# Altium schematic sheet Sitara_IO_Bank_45.SchDoc
size A3; SheetNumber: 8; SheetTotal: 10
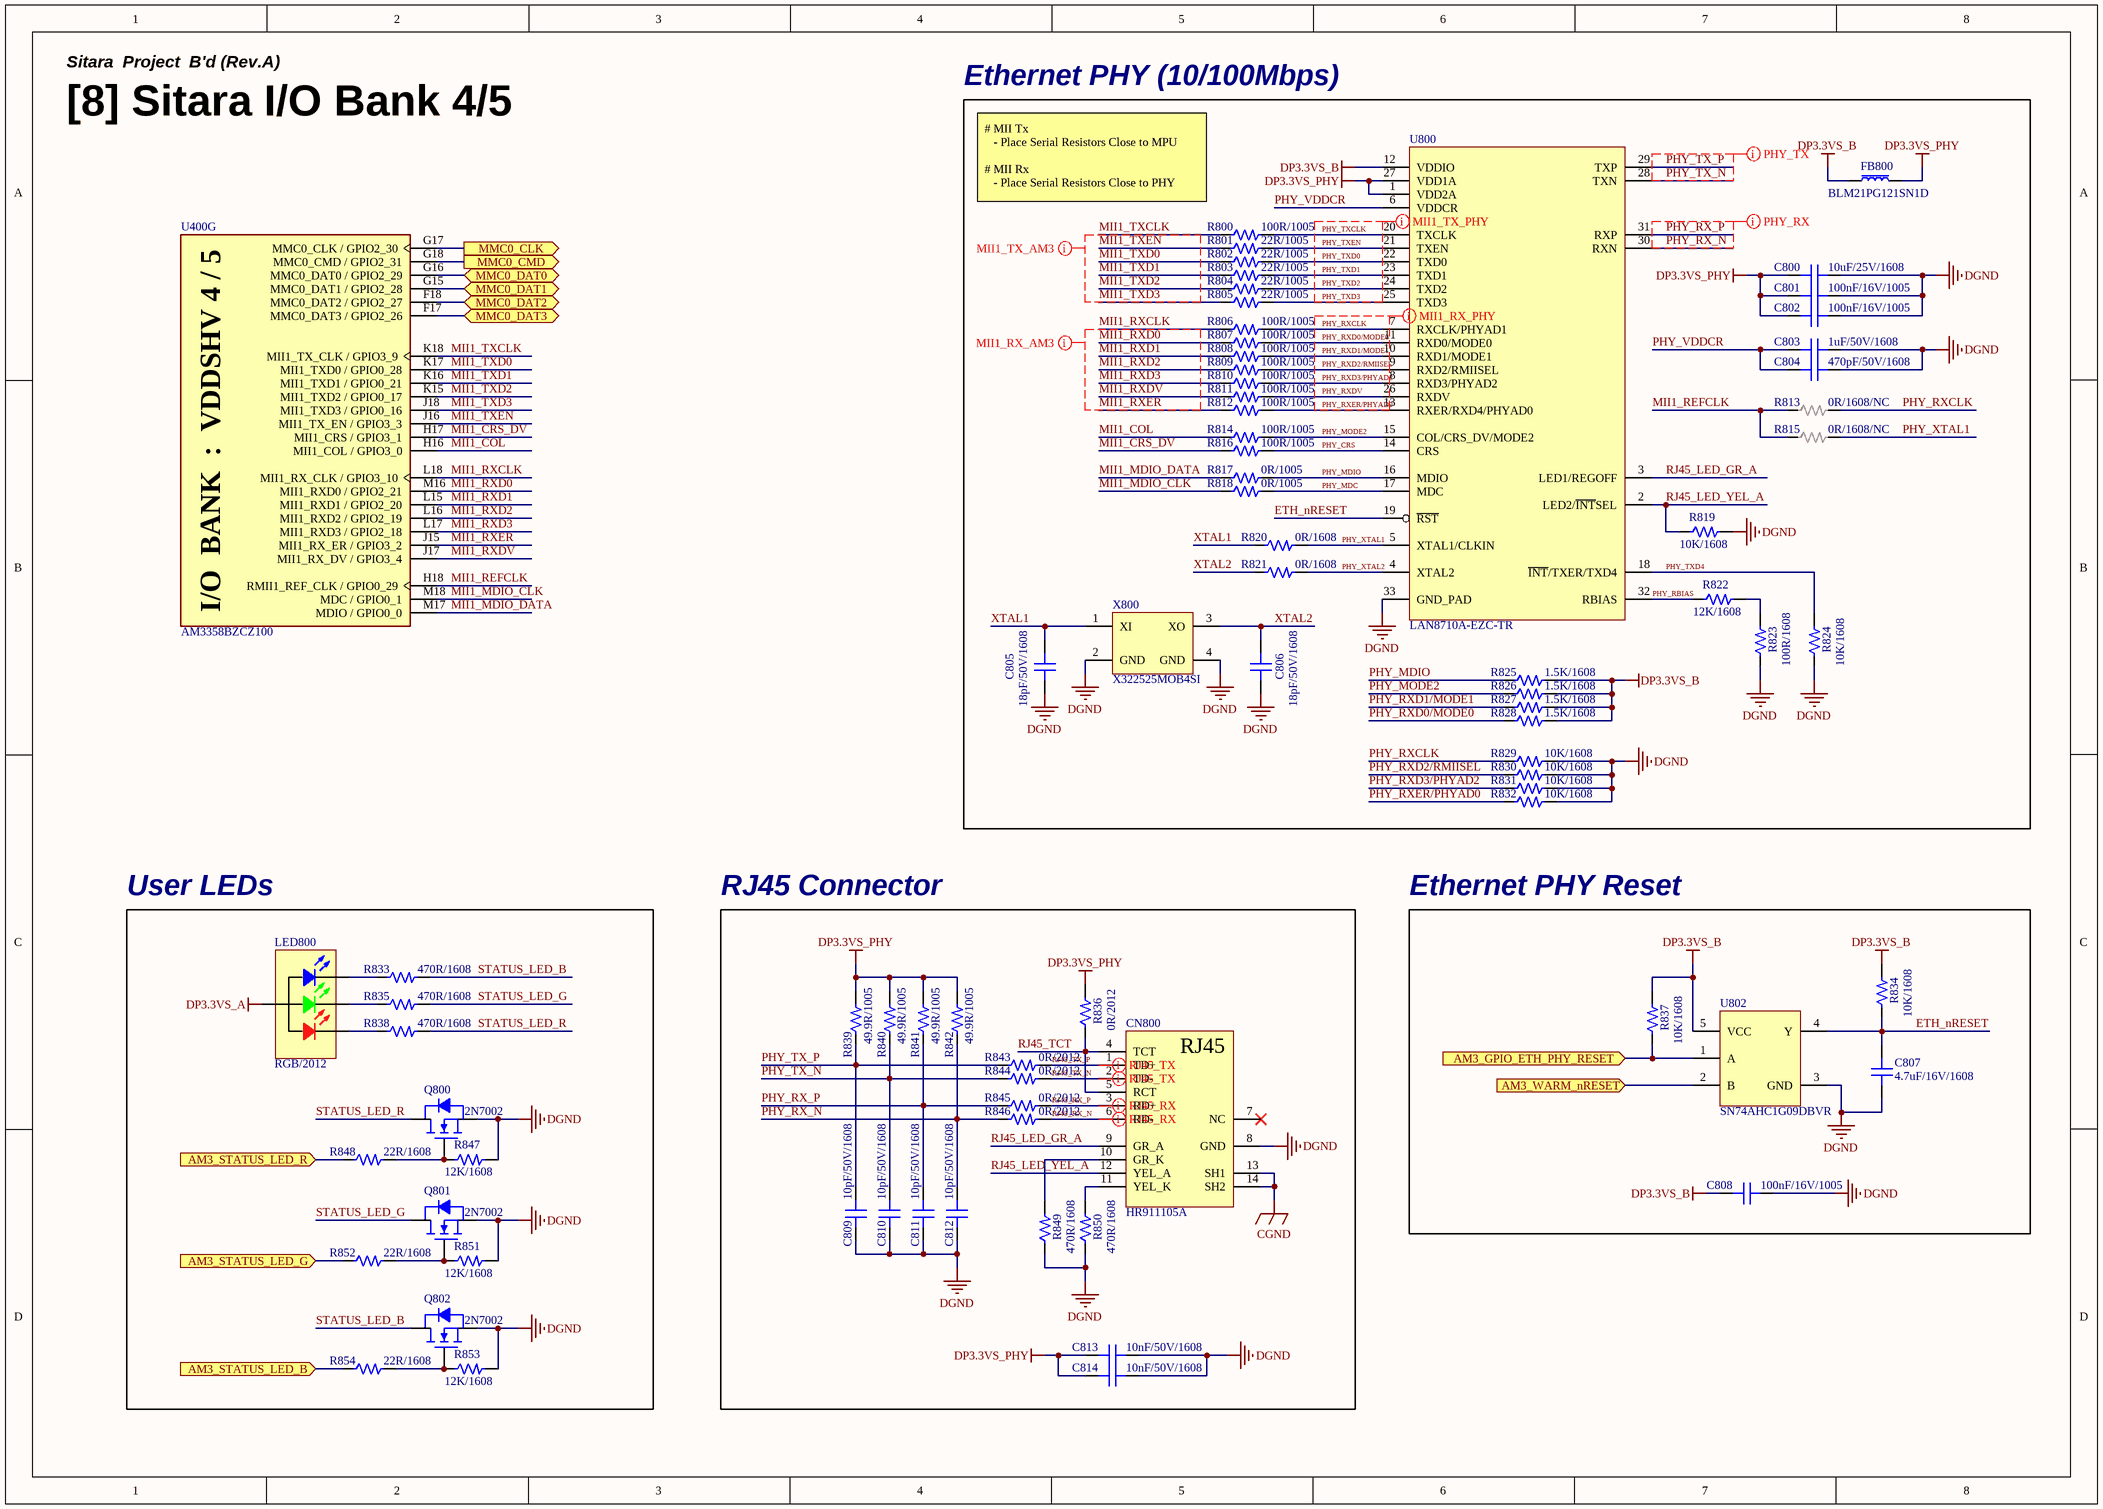
[diagram p0: Sitara_IO_Bank_45.SchDoc]

## Parts
C800  10uF/25V/1608  [CAP 1608 (0603_INCH)]
C801  100nF/16V/1005  [CAP 1005 (0402_INCH)]
C802  100nF/16V/1005  [CAP 1005 (0402_INCH)]
C803  1uF/50V/1608  [CAP 1608 (0603_INCH)]
C804  470pF/50V/1608  [CAP 1608 (0603_INCH)]
C805  18pF/50V/1608  [CAP 1608 (0603_INCH)]
C806  18pF/50V/1608  [CAP 1608 (0603_INCH)]
C807  4.7uF/16V/1608  [CAP 1608 (0603_INCH)]
C808  100nF/16V/1005  [CAP 1005 (0402_INCH)]
C809  10pF/50V/1608  [CAP 1608 (0603_INCH)]
C810  10pF/50V/1608  [CAP 1608 (0603_INCH)]
C811  10pF/50V/1608  [CAP 1608 (0603_INCH)]
C812  10pF/50V/1608  [CAP 1608 (0603_INCH)]
C813  10nF/50V/1608  [CAP 1608 (0603_INCH)]
C814  10nF/50V/1608  [CAP 1608 (0603_INCH)]
CN800  HR911105A  [CON_RJ45]
FB800  BLM21PG121SN1D  [FB 2012 (0805_inch)]
LED800  RGB/2012  [LED MHT170RGBCT]
Q800  2N7002  [SOT 23-3 (DIODES INCORPORATED)]
Q801  2N7002  [SOT 23-3 (DIODES INCORPORATED)]
Q802  2N7002  [SOT 23-3 (DIODES INCORPORATED)]
R800  100R/1005  [RES 1005 (0402_inch)]
R801  22R/1005  [RES 1005 (0402_inch)]
R802  22R/1005  [RES 1005 (0402_inch)]
R803  22R/1005  [RES 1005 (0402_inch)]
R804  22R/1005  [RES 1005 (0402_inch)]
R805  22R/1005  [RES 1005 (0402_inch)]
R806  100R/1005  [RES 1005 (0402_inch)]
R807  100R/1005  [RES 1005 (0402_inch)]
R808  100R/1005  [RES 1005 (0402_inch)]
R809  100R/1005  [RES 1005 (0402_inch)]
R810  100R/1005  [RES 1005 (0402_inch)]
R811  100R/1005  [RES 1005 (0402_inch)]
R812  100R/1005  [RES 1005 (0402_inch)]
R813  0R/1608/NC  [RES 1608 (0603_inch)/NC]
R814  100R/1005  [RES 1005 (0402_inch)]
R815  0R/1608/NC  [RES 1608 (0603_inch)/NC]
R816  100R/1005  [RES 1005 (0402_inch)]
R817  0R/1005  [RES 1005 (0402_inch)]
R818  0R/1005  [RES 1005 (0402_inch)]
R819  10K/1608  [RES 1608 (0603_inch)]
R820  0R/1608  [RES 1608 (0603_inch)]
R821  0R/1608  [RES 1608 (0603_inch)]
R822  12K/1608  [RES 1608 (0603_inch)]
R823  100R/1608  [RES 1608 (0603_inch)]
R824  10K/1608  [RES 1608 (0603_inch)]
R825  1.5K/1608  [RES 1608 (0603_inch)]
R826  1.5K/1608  [RES 1608 (0603_inch)]
R827  1.5K/1608  [RES 1608 (0603_inch)]
R828  1.5K/1608  [RES 1608 (0603_inch)]
R829  10K/1608  [RES 1608 (0603_inch)]
R830  10K/1608  [RES 1608 (0603_inch)]
R831  10K/1608  [RES 1608 (0603_inch)]
R832  10K/1608  [RES 1608 (0603_inch)]
R833  470R/1608  [RES 1608 (0603_inch)]
R834  10K/1608  [RES 1608 (0603_inch)]
R835  470R/1608  [RES 1608 (0603_inch)]
R836  0R/2012  [RES 2012 (0805_inch)]
R837  10K/1608  [RES 1608 (0603_inch)]
R838  470R/1608  [RES 1608 (0603_inch)]
R839  49.9R/1005  [RES 1005 (0402_inch)]
R840  49.9R/1005  [RES 1005 (0402_inch)]
R841  49.9R/1005  [RES 1005 (0402_inch)]
R842  49.9R/1005  [RES 1005 (0402_inch)]
R843  0R/2012  [RES 2012 (0805_inch)]
R844  0R/2012  [RES 2012 (0805_inch)]
R845  0R/2012  [RES 2012 (0805_inch)]
R846  0R/2012  [RES 2012 (0805_inch)]
R847  12K/1608  [RES 1608 (0603_inch)]
R848  22R/1608  [RES 1608 (0603_inch)]
R849  470R/1608  [RES 1608 (0603_inch)]
R850  470R/1608  [RES 1608 (0603_inch)]
R851  12K/1608  [RES 1608 (0603_inch)]
R852  22R/1608  [RES 1608 (0603_inch)]
R853  12K/1608  [RES 1608 (0603_inch)]
R854  22R/1608  [RES 1608 (0603_inch)]
U400  AM3358BZCZ100  [IC_SOC_AM3358BZCZ100]  (part G of 8)
U800  LAN8710A-EZC-TR  [IC_QFN-32 (5x5)]
U802  SN74AHC1G09DBVR  [SOT-23-5 (TI DBV PACKAGE)]
X800  X322525MOB4SI  [OSC_SMD_3.2x2.5(YXC)]

## Blocks framed on the sheet
Ethernet PHY (10/100Mbps): C800-C806 FB800 R800-R832 U800 X800
User LEDs: LED800 Q800-Q802 R833 R835 R838 R847 R848 R851-R854
RJ45 Connector: C809-C814 CN800 R836 R839-R846 R849 R850
Ethernet PHY Reset: C807 C808 R834 R837 U802

## Ports
AM3_GPIO_ETH_PHY_RESET (in, see Sitara_IO_Bank_6[2A]), AM3_STATUS_LED_B (in, see Sitara_Connectors[2C], Sitara_IO_Bank_6[2C]), AM3_STATUS_LED_G (in, see Sitara_Connectors[2C], Sitara_IO_Bank_6[2C]), AM3_STATUS_LED_R (in, see Sitara_Connectors[2C], Sitara_IO_Bank_6[2C]), AM3_WARM_nRESET (in, see Sitara_IO_Bank_6[2A], Sitara_IO_Bank_6[4B], Sitara_IO_Bank_6[4C]), MMC0_CLK (out, see Sitara_IO_Bank_123[5A]), MMC0_CMD (out, see Sitara_IO_Bank_123[5A]), MMC0_DAT0 (bidir, see Sitara_IO_Bank_123[5A]), MMC0_DAT1 (bidir, see Sitara_IO_Bank_123[5A]), MMC0_DAT2 (bidir, see Sitara_IO_Bank_123[5A]), MMC0_DAT3 (bidir, see Sitara_IO_Bank_123[5B])

## Nets
CGND: CN800.13(SH1) CN800.14(SH2)
DGND: C800.2 C801.2 C802.2 C803.2 C804.2 C805.1 C806.1 C807.1 C808.1 C809.1 C810.1 C811.1 C812.1 C813.2 C814.2 CN800.8(GND) Q800.2(S) Q801.2(S) Q802.2(S) R819.2 R823.1 R824.1 R829.2 R830.2 R831.2 R832.2 R847.2 R849.1 R850.1 R851.2 R853.2 U800.33(GND_PAD) U802.3(GND) X800.2(GND) X800.4(GND)
DP3.3VS_A: LED800.4(Common_Anode)
DP3.3VS_B: C808.2 FB800.1 R825.2 R826.2 R827.2 R828.2 R834.2 R837.2 U800.12(VDDIO) U802.5(VCC)
DP3.3VS_PHY: C800.1 C801.1 C802.1 C813.1 C814.1 FB800.2 R836.2 R839.2 R840.2 R841.2 R842.2 U800.1(VDD2A) U800.27(VDD1A)
AM3_GPIO_ETH_PHY_RESET: R837.1 U802.1(A) ; port AM3_GPIO_ETH_PHY_RESET
AM3_STATUS_LED_B: R854.1 ; port AM3_STATUS_LED_B
AM3_STATUS_LED_G: R852.1 ; port AM3_STATUS_LED_G
AM3_STATUS_LED_R: R848.1 ; port AM3_STATUS_LED_R
AM3_WARM_nRESET: U802.2(B) ; port AM3_WARM_nRESET
ETH_nRESET: C807.2 R834.1 U800.19(~{RST}) U802.4(Y)
MII1_COL: R814.1 U400.H16(MII1_COL_/_GPIO3_0)
MII1_CRS_DV: R816.1 U400.H17(MII1_CRS_/_GPIO3_1)
MII1_MDIO_CLK: R818.1 U400.M18(MDC_/_GPIO0_1)
MII1_MDIO_DATA: R817.1 U400.M17(MDIO_/_GPIO0_0)
MII1_REFCLK: R813.1 R815.1 U400.H18(RMII1_REF_CLK_/_GPIO0_29)
MII1_RXCLK: R806.1 U400.L18(MII1_RX_CLK_/_GPIO3_10)
MII1_RXD0: R807.1 U400.M16(MII1_RXD0_/_GPIO2_21)
MII1_RXD1: R808.1 U400.L15(MII1_RXD1_/_GPIO2_20)
MII1_RXD2: R809.1 U400.L16(MII1_RXD2_/_GPIO2_19)
MII1_RXD3: R810.1 U400.L17(MII1_RXD3_/_GPIO2_18)
MII1_RXDV: R811.1 U400.J17(MII1_RX_DV_/_GPIO3_4)
MII1_RXER: R812.1 U400.J15(MII1_RX_ER_/_GPIO3_2)
MII1_TXCLK: R800.1 U400.K18(MII1_TX_CLK_/_GPIO3_9)
MII1_TXD0: R802.1 U400.K17(MII1_TXD0_/_GPIO0_28)
MII1_TXD1: R803.1 U400.K16(MII1_TXD1_/_GPIO0_21)
MII1_TXD2: R804.1 U400.K15(MII1_TXD2_/_GPIO0_17)
MII1_TXD3: R805.1 U400.J18(MII1_TXD3_/_GPIO0_16)
MII1_TXEN: R801.1 U400.J16(MII1_TX_EN_/_GPIO3_3)
MMC0_CLK: U400.G17(MMC0_CLK_/_GPIO2_30) ; port MMC0_CLK
MMC0_CMD: U400.G18(MMC0_CMD_/_GPIO2_31) ; port MMC0_CMD
MMC0_DAT0: U400.G16(MMC0_DAT0_/_GPIO2_29) ; port MMC0_DAT0
MMC0_DAT1: U400.G15(MMC0_DAT1_/_GPIO2_28) ; port MMC0_DAT1
MMC0_DAT2: U400.F18(MMC0_DAT2_/_GPIO2_27) ; port MMC0_DAT2
MMC0_DAT3: U400.F17(MMC0_DAT3_/_GPIO2_26) ; port MMC0_DAT3
PHY_CRS: R816.2 U800.14(CRS)
PHY_MDC: R818.2 U800.17(MDC)
PHY_MDIO: R817.2 R825.1 U800.16(MDIO)
PHY_MODE2: R814.2 R826.1 U800.15(COL/CRS_DV/MODE2)
PHY_RBIAS: R822.1 U800.32(RBIAS)
PHY_RX_N: C812.2 R842.1 R846.1 U800.30(RXN)
PHY_RX_P: C811.2 R841.1 R845.1 U800.31(RXP)
PHY_RXCLK: R806.2 R813.2 R829.1 U800.7(RXCLK/PHYAD1)
PHY_RXD0/MODE0: R807.2 R828.1 U800.11(RXD0/MODE0)
PHY_RXD1/MODE1: R808.2 R827.1 U800.10(RXD1/MODE1)
PHY_RXD2/RMIISEL: R809.2 R830.1 U800.9(RXD2/RMIISEL)
PHY_RXD3/PHYAD2: R810.2 R831.1 U800.8(RXD3/PHYAD2)
PHY_RXDV: R811.2 U800.26(RXDV)
PHY_RXER/PHYAD0: R812.2 R832.1 U800.13(RXER/RXD4/PHYAD0)
PHY_TX_N: C810.2 R840.1 R844.1 U800.28(TXN)
PHY_TX_P: C809.2 R839.1 R843.1 U800.29(TXP)
PHY_TXCLK: R800.2 U800.20(TXCLK)
PHY_TXD0: R802.2 U800.22(TXD0)
PHY_TXD1: R803.2 U800.23(TXD1)
PHY_TXD2: R804.2 U800.24(TXD2)
PHY_TXD3: R805.2 U800.25(TXD3)
PHY_TXD4: R824.2 U800.18(~{INT}/TXER/TXD4)
PHY_TXEN: R801.2 U800.21(TXEN)
PHY_VDDCR: C803.1 C804.1 U800.6(VDDCR)
PHY_XTAL1: R815.2 R820.2 U800.5(XTAL1/CLKIN)
PHY_XTAL2: R821.2 U800.4(XTAL2)
RJ45_LED_GR_A: CN800.9(GR_A) U800.3(LED1/REGOFF)
RJ45_LED_YEL_A: CN800.12(YEL_A) R819.1 U800.2(LED2/~{INT}SEL)
RJ45_RX_N: CN800.6(RD-) R846.2
RJ45_RX_P: CN800.3(RD+) R845.2
RJ45_TCT: CN800.4(TCT) CN800.5(RCT) R836.1
RJ45_TX_N: CN800.2(TD-) R844.2
RJ45_TX_P: CN800.1(TD+) R843.2
STATUS_LED_B: Q802.3(D) R833.2
STATUS_LED_G: Q801.3(D) R835.2
STATUS_LED_R: Q800.3(D) R838.2
XTAL1: C805.2 R820.1 X800.1(XI)
XTAL2: C806.2 R821.1 X800.3(XO)
NetCN800_10: CN800.10(GR_K) R849.2
NetCN800_11: CN800.11(YEL_K) R850.2
NetLED800_1: LED800.1(RED) R838.1
NetLED800_2: LED800.2(GREEN) R835.1
NetLED800_3: LED800.3(BLUE) R833.1
NetQ800_1: Q800.1(G) R847.1 R848.2
NetQ801_1: Q801.1(G) R851.1 R852.2
NetQ802_1: Q802.1(G) R853.1 R854.2
NetR822_2: R822.2 R823.2

Not connected (* = marked no-connect by the designer): CN800 7(NC)*

## Layout directives
differential pair; differential pair class PHY_TX; rule Matched Net Lengths [Delay Tolerance = 10ps]: PHY_TX_N, PHY_TX_P
differential pair; differential pair class PHY_RX; rule Matched Net Lengths [Delay Tolerance = 10ps]: PHY_RX_N, PHY_RX_P
rule Matched Net Lengths [Delay Tolerance = 10ps]; net class MII1_TX_AM3: MII1_TXCLK, MII1_TXD0, MII1_TXD1, MII1_TXD2, MII1_TXD3, MII1_TXEN
rule Matched Net Lengths [Delay Tolerance = 10ps]; net class MII1_RX_PHY: PHY_RXCLK, PHY_RXD0/MODE0, PHY_RXD1/MODE1, PHY_RXD2/RMIISEL, PHY_RXD3/PHYAD2, PHY_RXDV, PHY_RXER/PHYAD0
rule Matched Net Lengths [Delay Tolerance = 10ps]; net class MII1_TX_PHY: PHY_TXCLK, PHY_TXD0, PHY_TXD1, PHY_TXD2, PHY_TXD3, PHY_TXEN
rule Matched Net Lengths [Delay Tolerance = 10ps]; net class MII1_RX_AM3: MII1_RXCLK, MII1_RXD0, MII1_RXD1, MII1_RXD2, MII1_RXD3, MII1_RXDV, MII1_RXER
differential pair; differential pair class RJ45_TX; rule Matched Net Lengths [Delay Tolerance = 10ps]: RJ45_TX_N, RJ45_TX_P
differential pair; differential pair class RJ45_RX; rule Matched Net Lengths [Delay Tolerance = 10ps]: RJ45_RX_N, RJ45_RX_P

## Notes on the sheet
- Sitara  Project  B'd (Rev.A)
- [8] Sitara I/O Bank 4/5
- # MII Tx
  - Place Serial Resistors Close to MPU
  # MII Rx
  - Place Serial Resistors Close to PHY
- (in symbol CON_RJ45_HR911105A) RJ45
- (in symbol IC_SOC_AM3358BZCZ100, part G) I/O  BANK  :  VDDSHV 4 / 5

## Library data of the parts
C800 = CAP_10uF/25V/1608: Ceramic CAP_10uF/25V/1608; LCSC Part #: C96446; JLCPCB Part Type: Basic Part
C801 C802 C808 = CAP_100nF/16V/1005: Ceramic CAP_100nF/16V/1005; LCSC Part #: C1525; JLCPCB Part Type: Basic Part
C803 = CAP_1uF/50V/1608: Ceramic CAP_1uF/50V/1608; LCSC Part #: C15849; JLCPCB Part Type: Basic Part
C804 = CAP_470pF/50V/1608: Ceramic CAP_470pF/50V/1608; LCSC Part #: C1620; JLCPCB Part Type: Basic Part
C805 C806 = CAP_18pF/50V/1608: Ceramic CAP_18pF/50V/1608; LCSC Part #: C1647; JLCPCB Part Type: Basic Part
C807 = CAP_4.7uF/16V/1608: Ceramic CAP_4.7uF/16V/1608; LCSC Part #: C19666; JLCPCB Part Type: Basic Part
C809-C812 = CAP_10pF/50V/1608: Ceramic CAP_10pF/50V/1608; LCSC Part #: C1634; JLCPCB Part Type: Basic Part
C813 C814 = CAP_10nF/50V/1608: Ceramic CAP_10nF/50V/1608; LCSC Part #: C57112; JLCPCB Part Type: Basic Part
CN800 = CON_RJ45_HR911105A: RJ45Receptacle 1 WithLED Plugin Ethernet Connectors / Modular Connectors (RJ45 RJ11) ROHS; LCSC Part #: C12074; JLCPCB Part Type: Extended Part
FB800 = FB_BLM21PG121SN1D: 3A 1 30mΩ 120Ω@100MHz ±25% 0805  Ferrite Beads ROHS; LCSC Part #: C79382; JLCPCB Part Type: Extended Part
LED800 = LED_RGB_MHT170RGBCT: Colorless transparence -30℃~+85℃ Positive post Common anode RGB 120° 0805  Light Emitting Diodes (LED) ROHS; LCSC Part #: C2962094; JLCPCB Part Type: Extended Part
Q800-Q802 = FET_2N7002: 60V 115mA 200mW 7.5Ω@10V,500mA N Channel SOT-23  MOSFETs ROHS; LCSC Part #: C8545; JLCPCB Part Type: Basic Part
R800 R806-R812 R814 R816 = RES_100R/1005/62.5mW: Value: 100R; Power Rating: 62.5mW; Precision: 1%; Size: 1005; LCSC Part #: C25076; JLCPCB Part Type: Basic Part
R801-R805 = RES_22R/1005/62.5mW: Value: 22R; Power Rating: 62.5mW; Precision: 1%; Size: 1005; LCSC Part #: C25092; JLCPCB Part Type: Basic Part
R813 R815 = RES_NC_0R/1608/0.1W: 0R/1608/0.1W/NC; Value: 0R; Power Rating: 0.1W; Precision: 1%; Size: 1608
R817 R818 = RES_0R/1005/62.5mW: Value: 0R; Power Rating: 62.5mW; Precision: 1%; Size: 1005; LCSC Part #: C17168; JLCPCB Part Type: Basic Part
R819 R824 R829-R832 R834 R837 = RES_10K/1608/0.1W: Value: 10K; Power Rating: 0.1W; Precision: 1%; Size: 1608; LCSC Part #: C25804; JLCPCB Part Type: Basic Part
R820 R821 = RES_0R/1608/0.1W: Value: 0R; Power Rating: 0.1W; Precision: 1%; Size: 1608; LCSC Part #: C21189; JLCPCB Part Type: Basic Part
R822 R847 R851 R853 = RES_12K/1608/0.1W: Value: 12K; Power Rating: 0.1W; Precision: 1%; Size: 1608; LCSC Part #: C22790; JLCPCB Part Type: Basic Part
R823 = RES_100R/1608/0.1W: Value: 100R; Power Rating: 0.1W; Precision: 1%; Size: 1608; LCSC Part #: C22775; JLCPCB Part Type: Basic Part
R825-R828 = RES_1.5K/1608/0.1W: Value: 1.5K; Power Rating: 0.1W; Precision: 1%; Size: 1608; LCSC Part #: C22843; JLCPCB Part Type: Basic Part
R833 R835 R838 R849 R850 = RES_470R/1608/0.1W: Value: 470R; Power Rating: 0.1W; Precision: 1%; Size: 1608; LCSC Part #: C23179; JLCPCB Part Type: Basic Part
R836 R843-R846 = RES_0R/2012/0.125W: Value: 0R; Power Rating: 0.125W; Precision: 1%; Size: 2012; LCSC Part #: C17477; JLCPCB Part Type: Basic Part
R839-R842 = RES_49.9R/1005/62.5mW: Value: 49.9R; Power Rating: 62.5mW; Precision: 1%; Size: 1005; LCSC Part #: C25120; JLCPCB Part Type: Basic Part
R848 R852 R854 = RES_22R/1608/0.1W: Value: 22R; Power Rating: 0.1W; Precision: 1%; Size: 1608; LCSC Part #: C23345; JLCPCB Part Type: Basic Part
U400 = IC_SOC_AM3358BZCZ100: ARM® Cortex®-A8 Microprocessor IC Sitara™ 1 Core, 32-Bit 1.0GHz 324-NFBGA (15x15); LCSC Part #: C73932; JLCPCB Part Type: Extended Part
U800 = IC_ETH_LAN8710A-EZC-TR: 4/4 Transceiver Full MII, RMII 32-QFN (5x5); LCSC Part #: C46185; JLCPCB Part Type: Extended Part
U802 = IC_AND_SN74AHC1G09DBVR: AND Gate IC 1 Channel Open Drain SOT-23-5; LCSC Part #: C840099; JLCPCB Part Type: Extended Part
X800 = XTAL_25MHz_X322525MOB4SI: 25MHz Surface Mount Crystal 12pF ±10ppm ±20ppm SMD3225-4P Crystals ROHS; LCSC Part #: C9006; JLCPCB Part Type: Basic Part